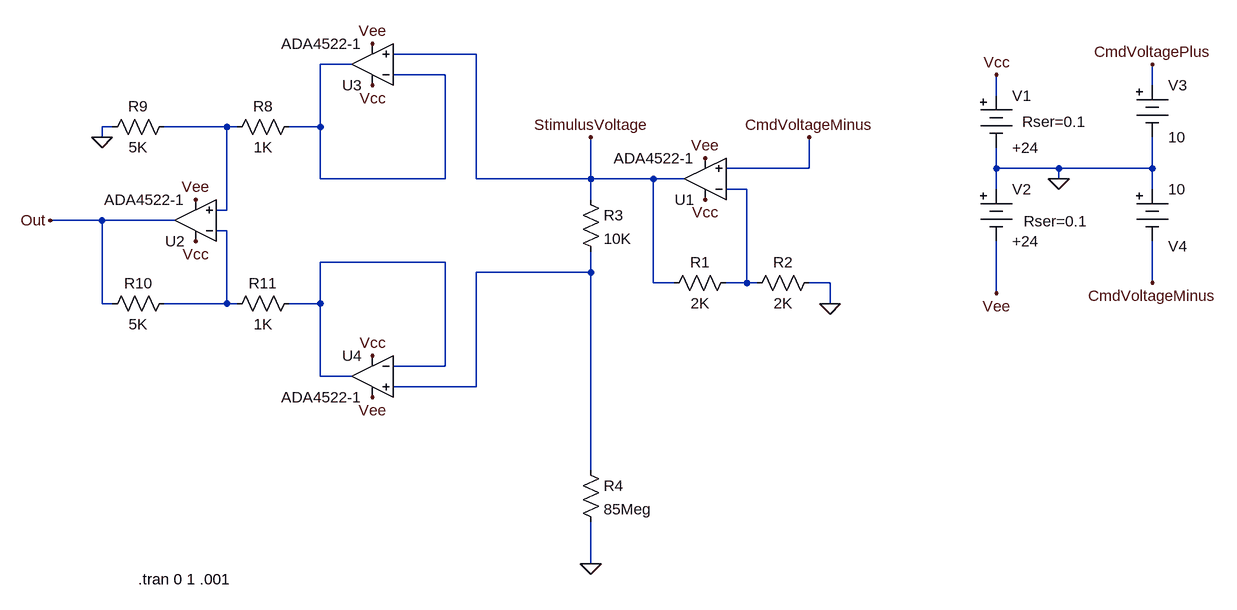
[diagram p0: schematic JukkaRev2_Model2C(012220).asc]
JukkaRev2_Model2C(012220).asc, the LTspice schematic file:
Version 4
SHEET 1 880 696
WIRE -448 -128 -576 -128
WIRE -640 -112 -688 -112
WIRE -496 -96 -576 -96
WIRE 592 -80 592 -112
WIRE 352 -64 352 -96
WIRE -1008 -16 -1024 -16
WIRE -832 -16 -928 -16
WIRE -816 -16 -832 -16
WIRE -688 -16 -688 -112
WIRE -688 -16 -736 -16
WIRE -1024 0 -1024 -16
WIRE 64 48 64 0
WIRE 64 48 -64 48
WIRE 352 48 352 16
WIRE 448 48 352 48
WIRE 592 48 592 0
WIRE 592 48 448 48
WIRE -688 64 -688 -16
WIRE -496 64 -496 -96
WIRE -496 64 -688 64
WIRE -448 64 -448 -128
WIRE -272 64 -272 0
WIRE -272 64 -448 64
WIRE -176 64 -272 64
WIRE -128 64 -176 64
WIRE 448 64 448 48
WIRE -32 80 -64 80
WIRE 352 80 352 48
WIRE 592 80 592 48
WIRE -272 96 -272 64
WIRE -832 112 -832 -16
WIRE -832 112 -848 112
WIRE -1024 128 -1104 128
WIRE -912 128 -1024 128
WIRE -832 144 -848 144
WIRE -496 192 -688 192
WIRE -272 208 -272 176
WIRE -272 208 -448 208
WIRE -176 224 -176 64
WIRE -144 224 -176 224
WIRE -32 224 -32 80
WIRE -32 224 -64 224
WIRE -16 224 -32 224
WIRE 96 224 64 224
WIRE 592 224 592 160
WIRE 352 240 352 160
WIRE -1024 256 -1024 128
WIRE -1008 256 -1024 256
WIRE -832 256 -832 144
WIRE -832 256 -928 256
WIRE -816 256 -832 256
WIRE -688 256 -688 192
WIRE -688 256 -736 256
WIRE 96 256 96 224
WIRE -496 352 -496 192
WIRE -496 352 -576 352
WIRE -688 368 -688 256
WIRE -640 368 -688 368
WIRE -448 384 -448 208
WIRE -448 384 -576 384
WIRE -272 512 -272 208
WIRE -272 656 -272 592
FLAG 448 64 0
FLAG 352 -96 Vcc
FLAG 352 240 Vee
FLAG -96 96 Vcc
FLAG 96 256 0
FLAG 592 -112 CmdVoltagePlus
FLAG 592 224 CmdVoltageMinus
FLAG 64 0 CmdVoltageMinus
FLAG -272 656 0
FLAG -272 0 StimulusVoltage
FLAG -608 -144 Vee
FLAG -608 -80 Vcc
FLAG -96 32 Vee
FLAG -608 400 Vee
FLAG -608 336 Vcc
FLAG -880 160 Vcc
FLAG -880 96 Vee
FLAG -1104 128 Out
FLAG -1024 0 0
SYMBOL Misc\\battery 352 -80 R0
WINDOW 123 0 0 Left 0
WINDOW 39 40 56 Left 2
SYMATTR SpiceLine Rser=0.1
SYMATTR InstName V1
SYMATTR Value +24
SYMBOL Misc\\battery 352 64 R0
WINDOW 123 0 0 Left 0
WINDOW 39 42 65 Left 2
SYMATTR SpiceLine Rser=0.1
SYMATTR InstName V2
SYMATTR Value +24
SYMBOL res -48 208 R90
WINDOW 0 0 56 VBottom 2
WINDOW 3 32 56 VTop 2
SYMATTR InstName R1
SYMATTR Value 2K
SYMBOL res 80 208 R90
WINDOW 0 0 56 VBottom 2
WINDOW 3 32 56 VTop 2
SYMATTR InstName R2
SYMATTR Value 2K
SYMBOL Misc\\battery 592 -96 R0
WINDOW 123 0 0 Left 0
WINDOW 39 0 0 Left 0
SYMATTR InstName V3
SYMATTR Value 10
SYMBOL Misc\\battery 592 64 R0
WINDOW 0 24 104 Left 2
WINDOW 3 24 16 Left 2
WINDOW 123 0 0 Left 0
WINDOW 39 0 0 Left 0
SYMATTR InstName V4
SYMATTR Value 10
SYMBOL res -288 80 R0
SYMATTR InstName R3
SYMATTR Value 10K
SYMBOL res -288 496 R0
SYMATTR InstName R4
SYMATTR Value 85Meg
SYMBOL res -720 -32 R90
WINDOW 0 0 56 VBottom 2
WINDOW 3 32 56 VTop 2
SYMATTR InstName R8
SYMATTR Value 1K
SYMBOL res -912 -32 R90
WINDOW 0 0 56 VBottom 2
WINDOW 3 32 56 VTop 2
SYMATTR InstName R9
SYMATTR Value 5K
SYMBOL res -912 240 R90
WINDOW 0 0 56 VBottom 2
WINDOW 3 32 56 VTop 2
SYMATTR InstName R10
SYMATTR Value 5K
SYMBOL res -720 240 R90
WINDOW 0 0 56 VBottom 2
WINDOW 3 32 56 VTop 2
SYMATTR InstName R11
SYMATTR Value 1K
SYMBOL Opamps\\ADA4522-1 -96 128 R180
SYMATTR InstName U1
SYMBOL Opamps\\ADA4522-1 -880 192 R180
SYMATTR InstName U2
SYMBOL Opamps\\ADA4522-1 -608 -48 R180
SYMATTR InstName U3
SYMBOL Opamps\\ADA4522-1 -608 304 M0
SYMATTR InstName U4
TEXT -968 680 Left 2 !.tran 0 1 .001

The netlist it stands for:
* JukkaRev2_Model2C(012220).asc
V1 Vcc 0 +24 Rser=0.1
V2 0 Vee +24 Rser=0.1
R1 N003 StimulusVoltage 2K
R2 0 N003 2K
V3 CmdVoltagePlus 0 10
V4 0 CmdVoltageMinus 10
R3 StimulusVoltage N006 10K
R4 N006 0 85Meg
R8 N001 N002 1K
R9 N002 0 5K
R10 N004 Out 5K
R11 N005 N004 1K
XU1 CmdVoltageMinus N003 Vcc Vee StimulusVoltage ADA4522-1  ; pins In+ In- V+ V- OUT
XU2 N002 N004 Vcc Vee Out ADA4522-1  ; pins In+ In- V+ V- OUT
XU3 StimulusVoltage N001 Vcc Vee N001 ADA4522-1  ; pins In+ In- V+ V- OUT
XU4 N006 N005 Vcc Vee N005 ADA4522-1  ; pins In+ In- V+ V- OUT
.tran 0 1 .001
.backanno
.end